# EasyEDA schematic 1-Schematic_braiNIAC_blueprints.json

## Sheets
1 Program Memory and Control Logic: TITLE: braiNIAC Program Memory and Control Logic; REV: 1.0; Date: 2018-12-09; Sheet: 1/2; Company: Bucher Industries
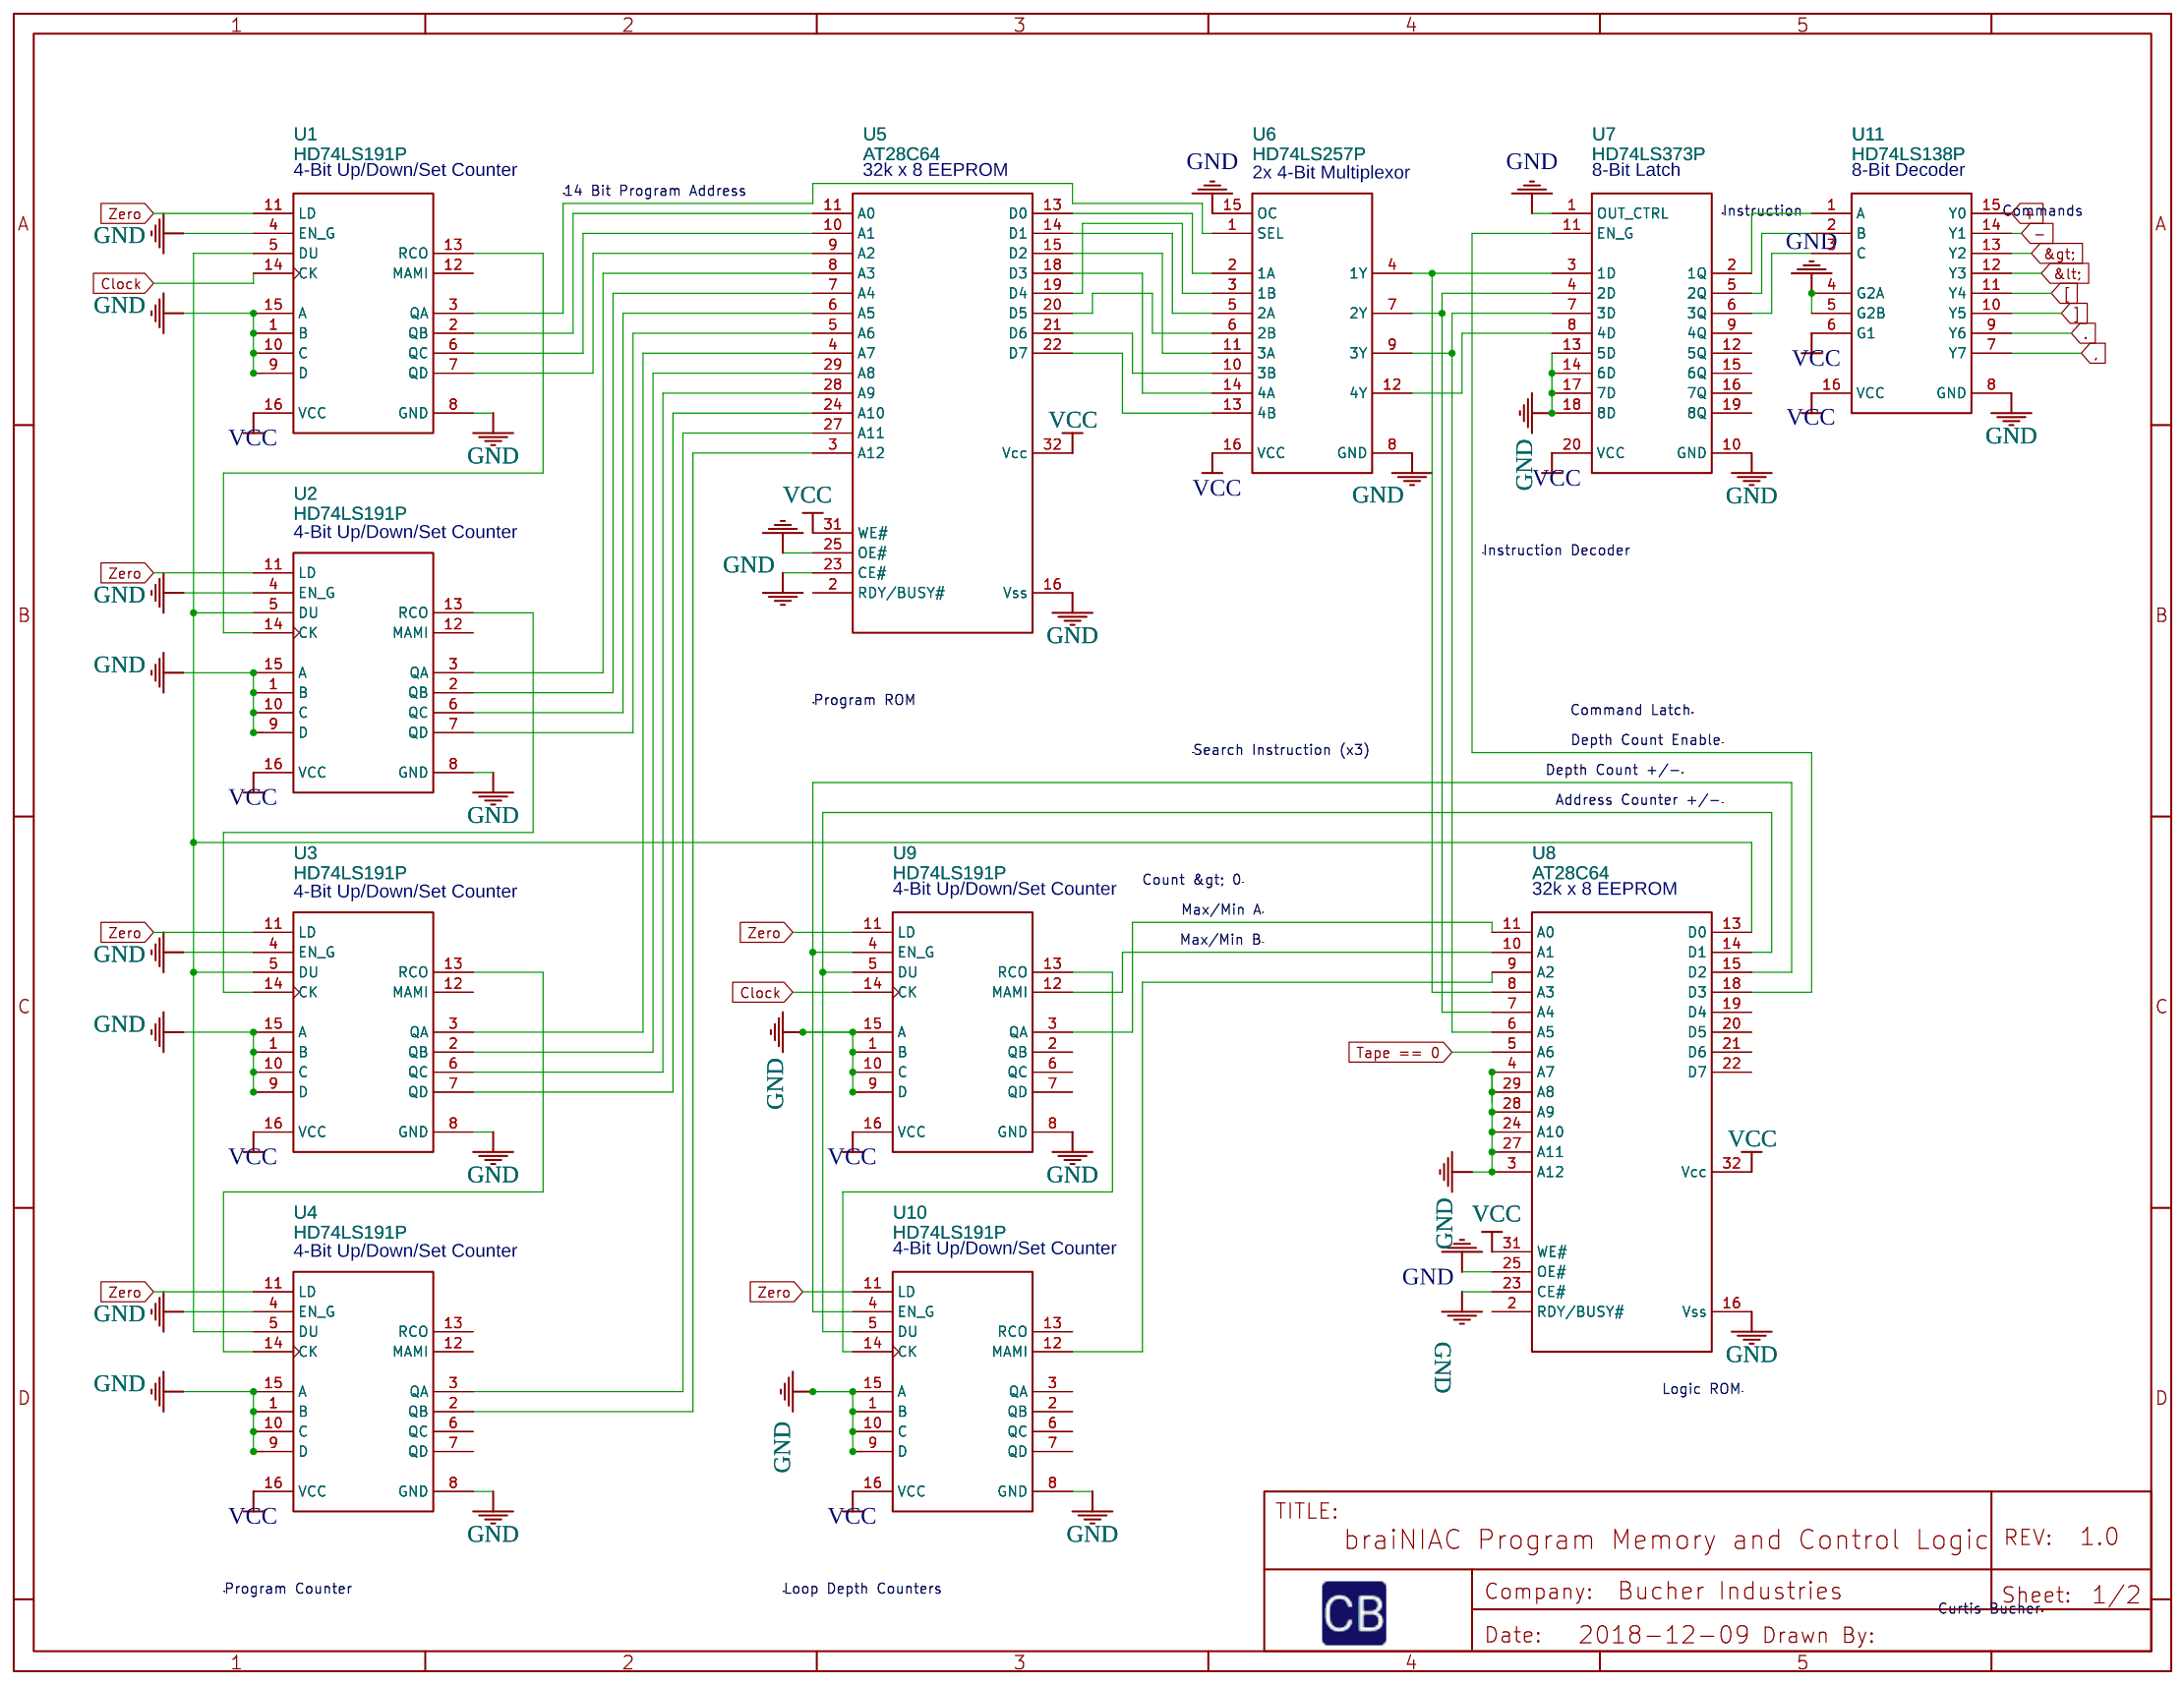
[diagram p0: Program Memory and Control Logic]
2 braiNIAC RAM and IO: TITLE: braiNIAC RAM, IO and POWER; Sheet: 2/2; Drawn By: Curtis Bucher
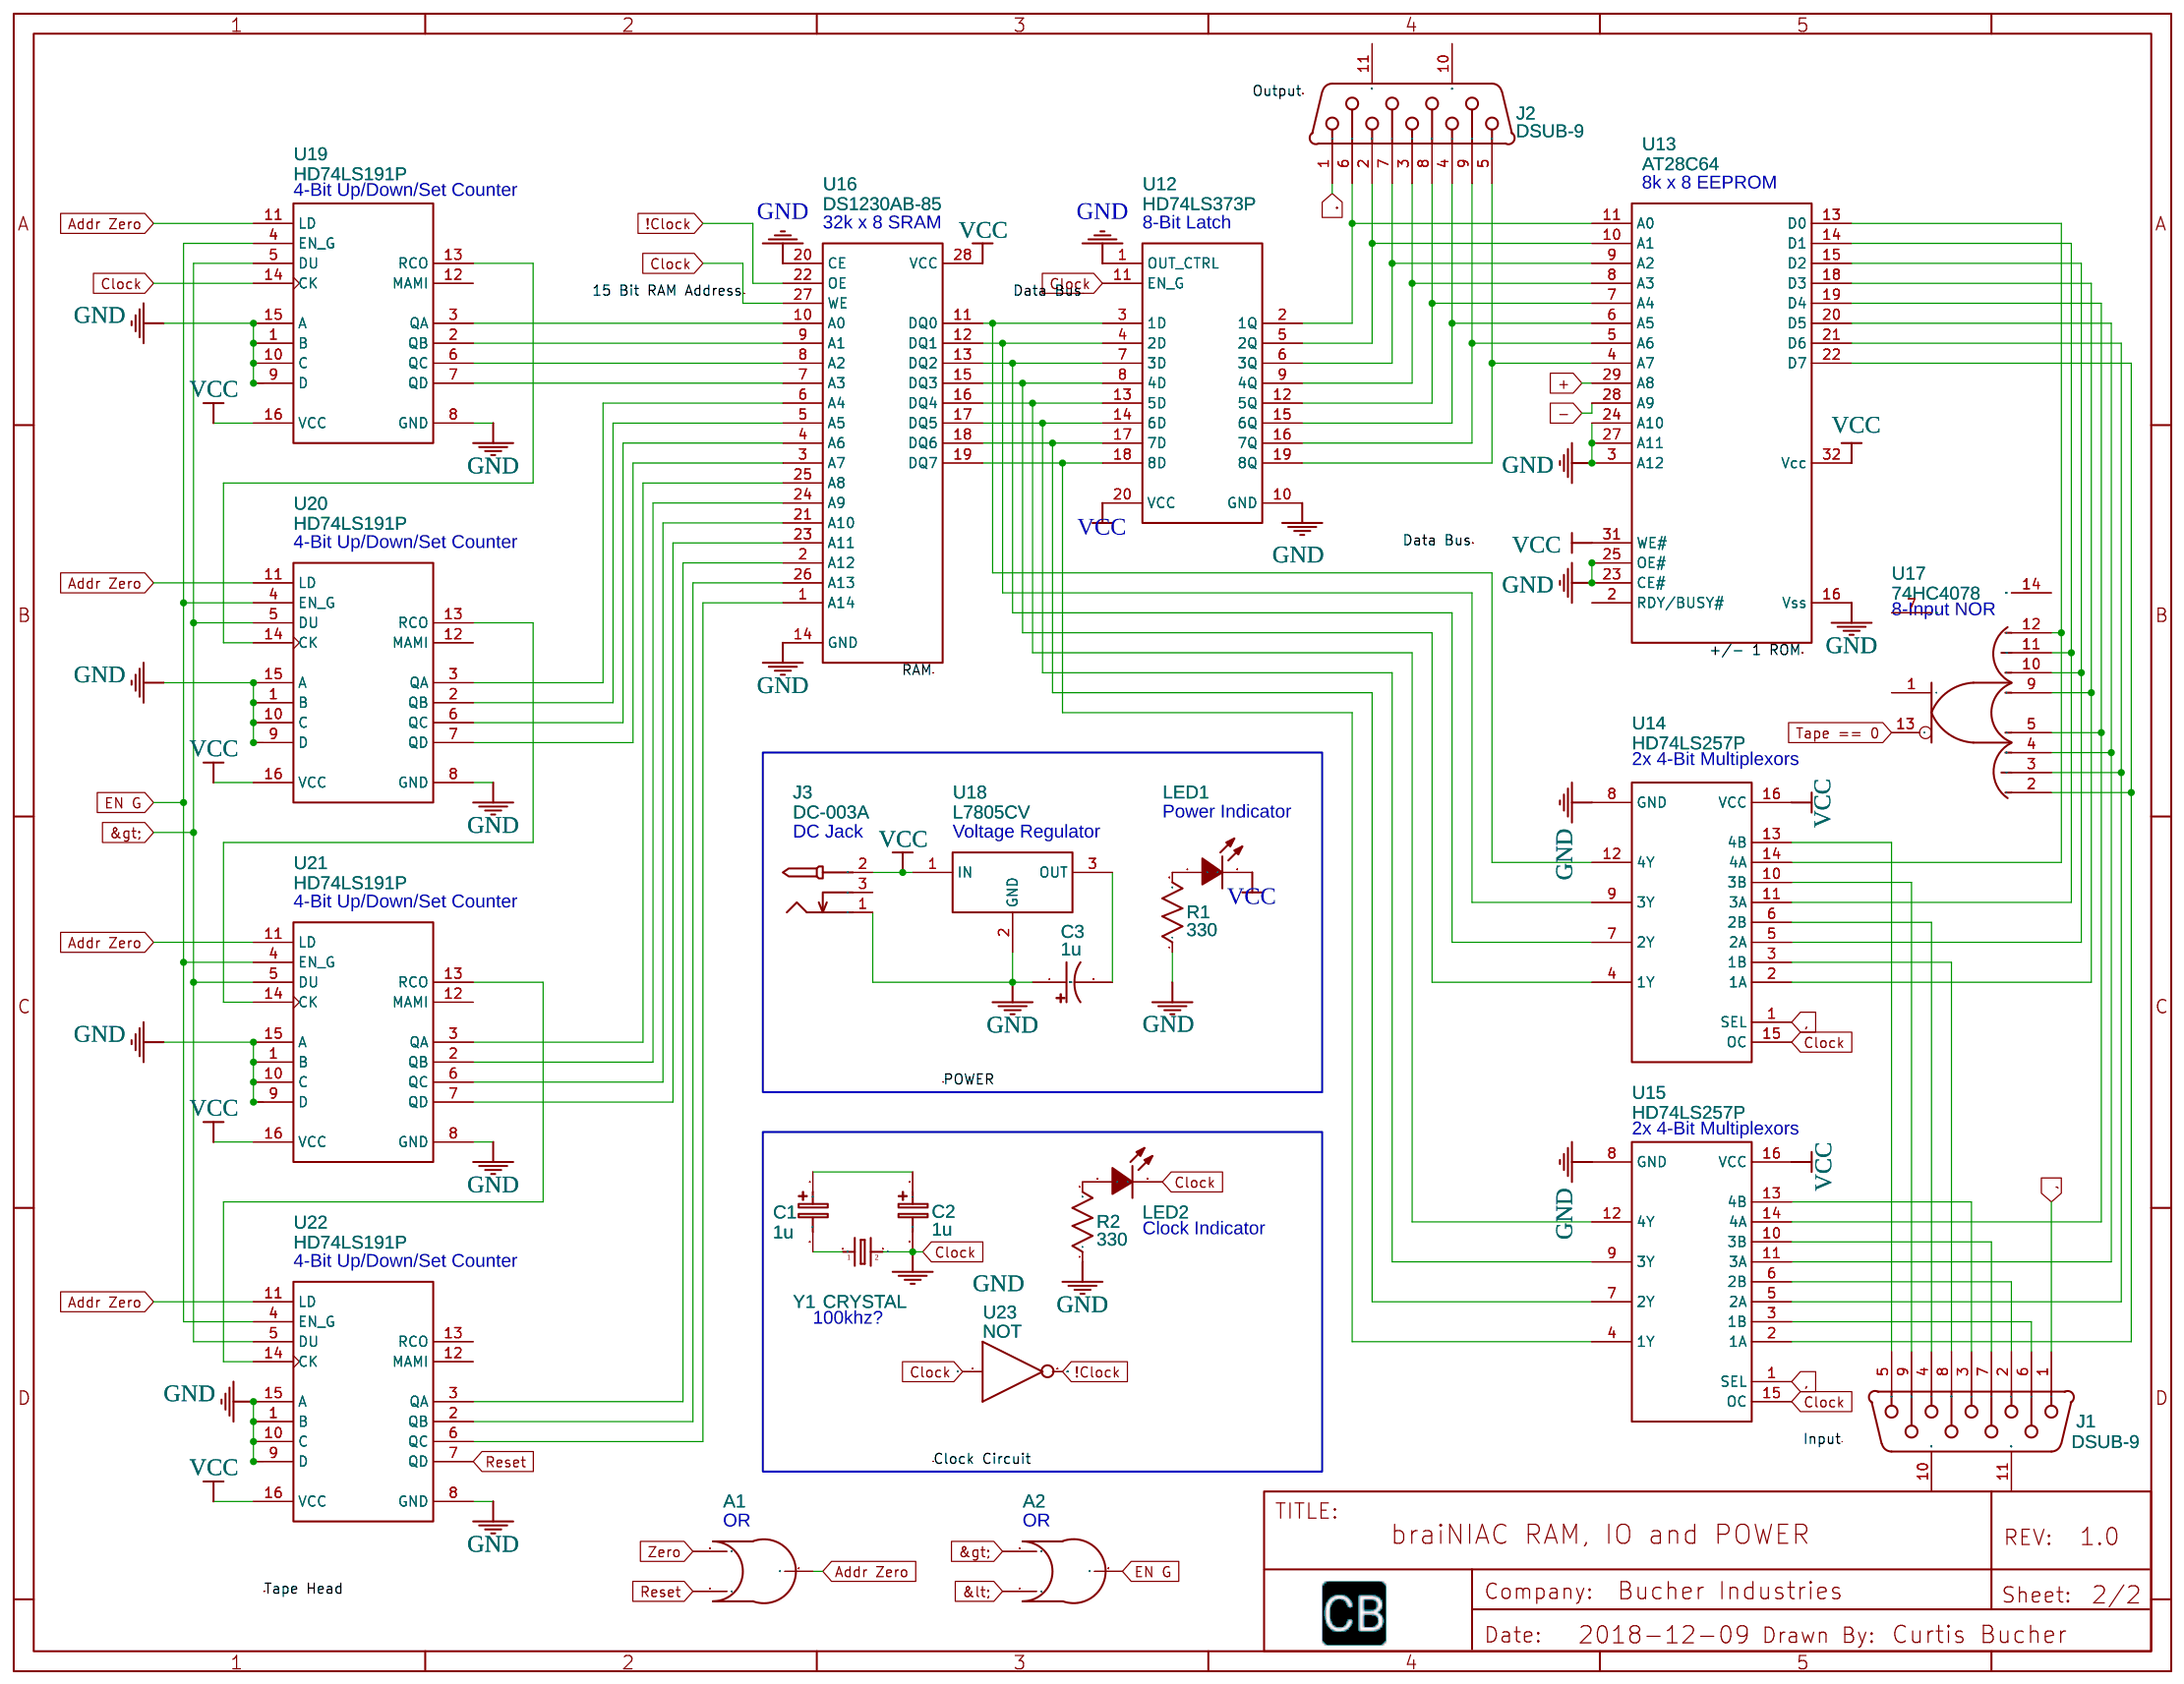
[diagram p1: braiNIAC RAM and IO]

## Parts
sheet braiNIAC RAM and IO
A1  OR
A2  OR
C1  1u  [CAP-D3.0XF1.5]
C2  1u  [CAP-D3.0XF1.5]
C3  1u  [CAP-D3.0XF1.5]
J1  DSUB-9  [DSUB9-FEMALE]
J2  DSUB-9  [DSUB9-FEMALE]
J3  DC-003A  [DC-003A]
LED1  204-10SURD/S530-A3  [LED-3MM/2.54]
LED2  204-10SURD/S530-A3  [LED-3MM/2.54]
R1  330  [AXIAL-0.3]
R2  330  [AXIAL-0.3]
U12  HD74LS373P  [DIP20]
U13  AT28C64  [PLCC32]
U14  HD74LS257P  [DIP16]
U15  HD74LS257P  [DIP16]
U16  DS1230AB-85  [ENDIP28A]
U17  74HC4078  [DIP14]
U18  L7805CV  [TO-220(TO-220-3)]
U19  HD74LS191P  [DIP16]
U20  HD74LS191P  [DIP16]
U21  HD74LS191P  [DIP16]
U22  HD74LS191P  [DIP16]
U23  NOT
Y1  CRYSTAL  [HC49US]
sheet Program Memory and Control Logic
U1  HD74LS191P  [DIP16]
U2  HD74LS191P  [DIP16]
U3  HD74LS191P  [DIP16]
U4  HD74LS191P  [DIP16]
U5  AT28C64  [PLCC32]
U6  HD74LS257P  [DIP16]
U7  HD74LS373P  [DIP20]
U8  AT28C64  [PLCC32]
U9  HD74LS191P  [DIP16]
U10  HD74LS191P  [DIP16]
U11  HD74LS138P  [DIP16]

## Library data of the parts
A1 A2 = -: Contributor: Marco Micheletto
C1 C2 = Cap_Electrolytic(TH)_D3.0XF1.5_EU: Contributor: EasyEDA
C3 = Cap_Electrolytic(TH)_D3.0XF1.5_US
J1 J2 = -: Supplier: LCSC; Manufacturer: CONNFLY; Manufacturer Part: DS1034-09FUNSi44; image: //image.lceda.cn/szlcsc/C77831.jpg; Contributor: LCSC; Supplier Part: C77831
J3 = -: Supplier: LCSC; Manufacturer: BOOMELE; Manufacturer Part: DC-003A 3.5Jacks; image: //image.lceda.cn/szlcsc/C3791.jpg; Supplier Part: C3791
LED1 LED2 = -: Supplier: LCSC; Manufacturer: EVERLIGHT; Supplier Part: C99772
R1 R2 = Res_AXIAL-0.3(1/8W)_US
U7 U12 = -: Octal D-Type Transparent Latches with 3-State Outputs
U5 U8 U13 = -: Manufacturer Part: 28C64A-25; Supplier Part: 74827; Supplier: Jameco; link: http://www.jameco.com/Jameco/Products/ProdDS/74827MCH.pdf; Contributor: golfballs32
U6 U14 U15 = -: Quad 2-Line-to-1-Line Data Selectors  Multiplexers with Non-Inverted 3-State Outputs
U16 = -: 256K Nonvolatile SRAM
U17 = -: 8-Input NOROR Gate
U18 = -: Supplier: LCSC; Manufacturer: STMicroelectronics; Supplier Part: C111887
U1-U4 U9 U10 U19-U22 = -: Synchronous Up  Down 4-bit Binary Counter with Single Clock Line
U23 = NOT: Contributor: marcio.menezes
Y1 = -: Contributor: SparkFun
U11 = -: 3-to-8-Line Decoder  Demultiplexer

## Nets
VCC: J3.2 LED1.2(K) U1.16(VCC) U2.16(VCC) U3.16(VCC) U4.16(VCC) U5.31(WE#) U5.32(Vcc) U6.16(VCC) U7.20(VCC) U8.31(WE#) U8.32(Vcc) U9.16(VCC) U10.16(VCC) U11.6(G1) U11.16(VCC) U12.20(VCC) U13.31(WE#) U13.32(Vcc) U14.16(VCC) U15.16(VCC) U16.28(VCC) U18.1(IN) U19.16(VCC) U20.16(VCC) U21.16(VCC) U22.16(VCC)
15 Bit RAM Address: C2.2 C3.1 J3.1 LED2.2(K) R1.1 R2.1 U1.1(B) U1.4(EN G) U1.8(GND) U1.9(D) U1.10(C) U1.14(CK) U1.15(A) U2.1(B) U2.4(EN G) U2.8(GND) U2.9(D) U2.10(C) U2.15(A) U3.1(B) U3.4(EN G) U3.8(GND) U3.9(D) U3.10(C) U3.15(A) U4.1(B) U4.4(EN G) U4.8(GND) U4.9(D) U4.10(C) U4.15(A) U5.16(Vss) U5.23(CE#) U5.25(OE#) U6.8(GND) U6.15(OC) U7.1(OUT CTRL) U7.10(GND) U7.13(5D) U7.14(6D) U7.17(7D) U7.18(8D) U8.3(A12) U8.4(A7) U8.16(Vss) U8.23(CE#) U8.24(A10) U8.25(OE#) U8.27(A11) U8.28(A9) U8.29(A8) U9.1(B) U9.8(GND) U9.9(D) U9.10(C) U9.14(CK) U9.15(A) U10.1(B) U10.8(GND) U10.9(D) U10.10(C) U10.15(A) U11.4(G2A) U11.5(G2B) U11.8(GND) U12.1(OUT CTRL) U12.10(GND) U12.11(EN G) U13.3(A12) U13.16(Vss) U13.23(CE#) U13.24(A10) U13.25(OE#) U13.27(A11) U14.8(GND) U14.15(OC) U15.8(GND) U15.15(OC) U16.14(GND) U16.20(CE) U16.27(WE) U18.2(GND) U19.1(B) U19.8(GND) U19.9(D) U19.10(C) U19.14(CK) U19.15(A) U20.1(B) U20.8(GND) U20.9(D) U20.10(C) U20.15(A) U21.1(B) U21.8(GND) U21.9(D) U21.10(C) U21.15(A) U22.1(B) U22.8(GND) U22.9(D) U22.10(C) U22.15(A) U23.1(INA) Y1.2
!Clock: U16.22(OE) U23.5(OUT)
>: A2.1 U11.13(Y2) U19.5(DU) U20.5(DU) U21.5(DU) U22.5(DU)
<: A2.2 U11.12(Y3)
+: U11.15(Y0) U13.29(A8)
,: J1.1 U11.7(Y7) U14.1(SEL) U15.1(SEL)
-: U11.14(Y1) U13.28(A9)
.: J2.1 U11.9(Y6)
[: U11.11(Y4)
]: U11.10(Y5)
Addr Zero: A1.3 U19.11(LD) U20.11(LD) U21.11(LD) U22.11(LD)
EN G: A2.3 U19.4(EN G) U20.4(EN G) U21.4(EN G) U22.4(EN G)
Reset: A1.2 U22.7(QD)
Tape == 0: U8.5(A6) U17.13(Y)
Zero: A1.1 U1.11(LD) U2.11(LD) U3.11(LD) U4.11(LD) U9.11(LD) U10.11(LD)
Net-(C1-1): C1.1 C2.1
Net-(C1-2): C1.2 Y1.1
Net-(C3-2): C3.2 U18.3(OUT)
Net-(J1-2): J1.2 U15.6(2B)
Net-(J1-3): J1.3 U15.13(4B)
Net-(J1-4): J1.4 U14.6(2B)
Net-(J1-5): J1.5 U14.13(4B)
Net-(J1-6): J1.6 U15.3(1B)
Net-(J1-7): J1.7 U15.10(3B)
Net-(J1-8): J1.8 U14.3(1B)
Net-(J1-9): J1.9 U14.10(3B)
Net-(J2-2): J2.2 U12.5(2Q) U13.10(A1)
Net-(J2-3): J2.3 U12.9(4Q) U13.8(A3)
Net-(J2-4): J2.4 U12.15(6Q) U13.6(A5)
Net-(J2-5): J2.5 U12.19(8Q) U13.4(A7)
Net-(J2-6): J2.6 U12.2(1Q) U13.11(A0)
Net-(J2-7): J2.7 U12.6(3Q) U13.9(A2)
Net-(J2-8): J2.8 U12.12(5Q) U13.7(A4)
Net-(J2-9): J2.9 U12.16(7Q) U13.5(A6)
Net-(LED1-1): LED1.1(A) R1.2
Net-(LED2-1): LED2.1(A) R2.2
Net-(U1-2): U1.2(QB) U5.11(A0)
Net-(U1-3): U1.3(QA) U6.1(SEL)
Net-(U1-5): U1.5(DU) U2.5(DU) U3.5(DU) U4.5(DU) U8.13(D0)
Net-(U1-6): U1.6(QC) U5.10(A1)
Net-(U1-7): U1.7(QD) U5.9(A2)
Net-(U1-13): U1.13(RCO) U2.14(CK)
Net-(U2-2): U2.2(QB) U5.7(A4)
Net-(U2-3): U2.3(QA) U5.8(A3)
Net-(U2-6): U2.6(QC) U5.6(A5)
Net-(U2-7): U2.7(QD) U5.5(A6)
Net-(U2-13): U2.13(RCO) U3.14(CK)
Net-(U3-2): U3.2(QB) U5.29(A8)
Net-(U3-3): U3.3(QA) U5.4(A7)
Net-(U3-6): U3.6(QC) U5.28(A9)
Net-(U3-7): U3.7(QD) U5.24(A10)
Net-(U3-13): U3.13(RCO) U4.14(CK)
Net-(U4-2): U4.2(QB) U5.3(A12)
Net-(U4-3): U4.3(QA) U5.27(A11)
Net-(U5-13): U5.13(D0) U6.2(1A)
Net-(U5-14): U5.14(D1) U6.5(2A)
Net-(U5-15): U5.15(D2) U6.11(3A)
Net-(U5-18): U5.18(D3) U6.14(4A)
Net-(U5-19): U5.19(D4) U6.3(1B)
Net-(U5-20): U5.20(D5) U6.6(2B)
Net-(U5-21): U5.21(D6) U6.10(3B)
Net-(U5-22): U5.22(D7) U6.13(4B)
Net-(U6-4): U6.4(1Y) U7.3(1D) U8.8(A3)
Net-(U6-7): U6.7(2Y) U7.4(2D) U8.7(A4)
Net-(U6-9): U6.9(3Y) U7.7(3D) U8.6(A5)
Net-(U6-12): U6.12(4Y) U7.8(4D)
Net-(U7-2): U7.2(1Q) U11.1(A)
Net-(U7-5): U7.5(2Q) U11.2(B)
Net-(U7-6): U7.6(3Q) U11.3(C)
Net-(U7-11): U7.11(EN G) U8.18(D3)
Net-(U8-9): U8.9(A2) U10.12(MAMI)
Net-(U8-10): U8.10(A1) U9.12(MAMI)
Net-(U8-11): U8.11(A0) U9.3(QA)
Net-(U8-14): U8.14(D1) U9.5(DU) U10.5(DU)
Net-(U8-15): U8.15(D2) U9.4(EN G) U10.4(EN G)
Net-(U9-13): U9.13(RCO) U10.14(CK)
Net-(U12-3): U12.3(1D) U14.12(4Y) U16.11(DQ0)
Net-(U12-4): U12.4(2D) U14.9(3Y) U16.12(DQ1)
Net-(U12-7): U12.7(3D) U14.7(2Y) U16.13(DQ2)
Net-(U12-8): U12.8(4D) U14.4(1Y) U16.15(DQ3)
Net-(U12-13): U12.13(5D) U15.12(4Y) U16.16(DQ4)
Net-(U12-14): U12.14(6D) U15.9(3Y) U16.17(DQ5)
Net-(U12-17): U12.17(7D) U15.7(2Y) U16.18(DQ6)
Net-(U12-18): U12.18(8D) U15.4(1Y) U16.19(DQ7)
Net-(U13-13): U13.13(D0) U14.14(4A) U17.12(H)
Net-(U13-14): U13.14(D1) U14.11(3A) U17.11(G)
Net-(U13-15): U13.15(D2) U14.5(2A) U17.10(F)
Net-(U13-18): U13.18(D3) U14.2(1A) U17.9(E)
Net-(U13-19): U13.19(D4) U15.14(4A) U17.5(D)
Net-(U13-20): U13.20(D5) U15.11(3A) U17.4(C)
Net-(U13-21): U13.21(D6) U15.5(2A) U17.3(B)
Net-(U13-22): U13.22(D7) U15.2(1A) U17.2(A)
Net-(U16-1): U16.1(A14) U22.6(QC)
Net-(U16-2): U16.2(A12) U22.3(QA)
Net-(U16-3): U16.3(A7) U20.7(QD)
Net-(U16-4): U16.4(A6) U20.6(QC)
Net-(U16-5): U16.5(A5) U20.2(QB)
Net-(U16-6): U16.6(A4) U20.3(QA)
Net-(U16-7): U16.7(A3) U19.7(QD)
Net-(U16-8): U16.8(A2) U19.6(QC)
Net-(U16-9): U16.9(A1) U19.2(QB)
Net-(U16-10): U16.10(A0) U19.3(QA)
Net-(U16-21): U16.21(A10) U21.6(QC)
Net-(U16-23): U16.23(A11) U21.7(QD)
Net-(U16-24): U16.24(A9) U21.2(QB)
Net-(U16-25): U16.25(A8) U21.3(QA)
Net-(U16-26): U16.26(A13) U22.2(QB)
Net-(U19-13): U19.13(RCO) U20.14(CK)
Net-(U20-13): U20.13(RCO) U21.14(CK)
Net-(U21-13): U21.13(RCO) U22.14(CK)

Not connected (* = marked no-connect by the designer): J1 10(MH1) 11(MH2); J2 10(MH1) 11(MH2); J3 3; U1 12(MAMI); U2 12(MAMI); U3 12(MAMI); U4 6(QC) 7(QD) 12(MAMI) 13(RCO); U5 2(RDY/BUSY#); U7 9(4Q) 12(5Q) 15(6Q) 16(7Q) 19(8Q); U8 2(RDY/BUSY#) 19(D4) 20(D5) 21(D6) 22(D7); U9 2(QB) 6(QC) 7(QD); U10 2(QB) 3(QA) 6(QC) 7(QD) 13(RCO); U13 2(RDY/BUSY#); U17 1(X) 7(GND) 14(VDD); U19 12(MAMI); U20 12(MAMI); U21 12(MAMI); U22 12(MAMI) 13(RCO)

## Notes on the sheets
sheet 1
- 4-Bit Up/Down/Set Counter
- 32k x 8 EEPROM
- 2x 4-Bit Multiplexor
- 8-Bit Latch
- 8-Bit Decoder
- 4-Bit Up/Down/Set Counter
- 4-Bit Up/Down/Set Counter
- 4-Bit Up/Down/Set Counter
- 32k x 8 EEPROM
- 4-Bit Up/Down/Set Counter
- 4-Bit Up/Down/Set Counter
sheet 2
- 4-Bit Up/Down/Set Counter
- 8k x 8 EEPROM
- 32k x 8 SRAM
- 8-Bit Latch
- 4-Bit Up/Down/Set Counter
- 8-Input NOR
- 2x 4-Bit Multiplexors
- Power Indicator
- DC Jack
- Voltage Regulator
- 4-Bit Up/Down/Set Counter
- 2x 4-Bit Multiplexors
- Clock Indicator
- 4-Bit Up/Down/Set Counter
- 100khz?
- OR
- OR
